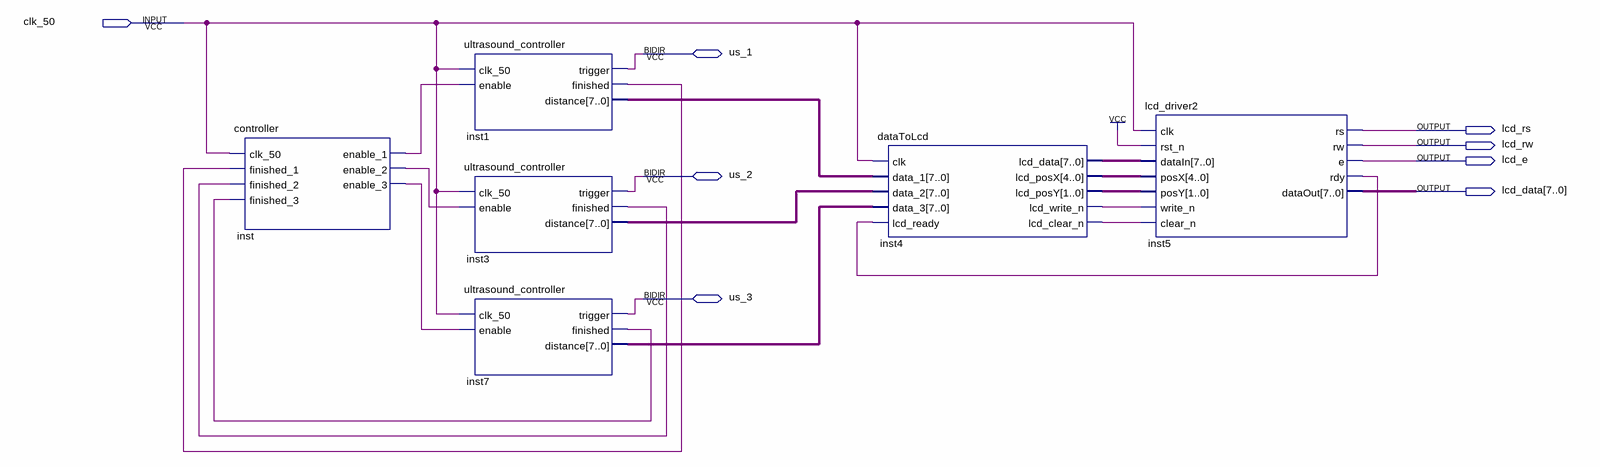
[diagram p0: schematic sheet]
// Quartus schematic ultrasound_reader.bdf as structural Verilog: 6 symbols, 8 pins
module ultrasound_reader (
  input  clk_50,
  inout  us_1,
  inout  us_2,
  inout  us_3,
  output lcd_rs,
  output lcd_rw,
  output lcd_e,
  output [7:0] lcd_data
);

  wire inst1_finished, inst3_finished, inst4_lcd_clear_n, inst4_lcd_write_n, inst5_rdy, inst7_finished,
       inst_enable_1, inst_enable_2, inst_enable_3;
  wire [1:0] inst4_lcd_posy;
  wire [4:0] inst4_lcd_posx;
  wire [7:0] inst1_distance, inst3_distance, inst4_lcd_data, inst7_distance;

  controller inst (
    .clk_50(clk_50), .finished_1(inst1_finished), .finished_2(inst3_finished), .finished_3(inst7_finished),
    .enable_1(inst_enable_1), .enable_2(inst_enable_2), .enable_3(inst_enable_3));
  ultrasound_controller inst1 (
    .clk_50(clk_50), .enable(inst_enable_1), .finished(inst1_finished), .distance(inst1_distance),
    .trigger(us_1));
  ultrasound_controller inst3 (
    .clk_50(clk_50), .enable(inst_enable_2), .finished(inst3_finished), .distance(inst3_distance),
    .trigger(us_2));
  ultrasound_controller inst7 (
    .clk_50(clk_50), .enable(inst_enable_3), .finished(inst7_finished), .distance(inst7_distance),
    .trigger(us_3));
  dataToLcd inst4 (
    .clk(clk_50), .data_1(inst1_distance), .data_2(inst3_distance), .data_3(inst7_distance),
    .lcd_ready(inst5_rdy), .lcd_data(inst4_lcd_data), .lcd_posX(inst4_lcd_posx), .lcd_posY(inst4_lcd_posy),
    .lcd_write_n(inst4_lcd_write_n), .lcd_clear_n(inst4_lcd_clear_n));
  lcd_driver2 inst5 (
    .clk(clk_50), .rst_n(1'b1), .dataIn(inst4_lcd_data), .posX(inst4_lcd_posx), .posY(inst4_lcd_posy),
    .write_n(inst4_lcd_write_n), .clear_n(inst4_lcd_clear_n), .rs(lcd_rs), .rw(lcd_rw), .e(lcd_e),
    .rdy(inst5_rdy), .dataOut(lcd_data));
endmodule
